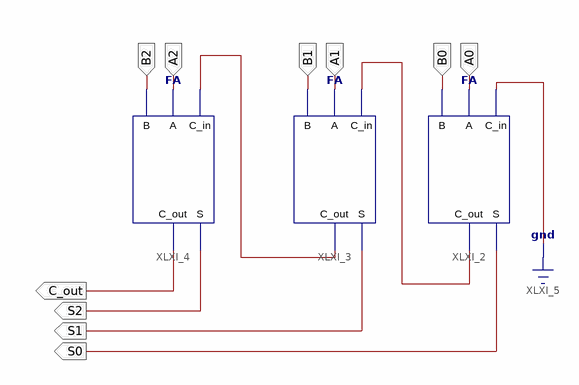
[diagram p0: schematic sheet 1]
// Xilinx ISE schematic bit_adder_3.sch (spartan3e) as structural Verilog: 3 symbols, 10 ports
module bit_adder_3 (
  input  A0,
  input  B0,
  input  A1,
  input  B1,
  input  A2,
  input  B2,
  output S0,
  output S1,
  output S2,
  output C_out
);

  wire XLXN_2, XLXN_3;

  FA XLXI_2 (.A(A0), .B(B0), .C_in(1'b0), .C_out(XLXN_2), .S(S0));
  FA XLXI_3 (.A(A1), .B(B1), .C_in(XLXN_2), .C_out(XLXN_3), .S(S1));
  FA XLXI_4 (.A(A2), .B(B2), .C_in(XLXN_3), .C_out(C_out), .S(S2));
endmodule
